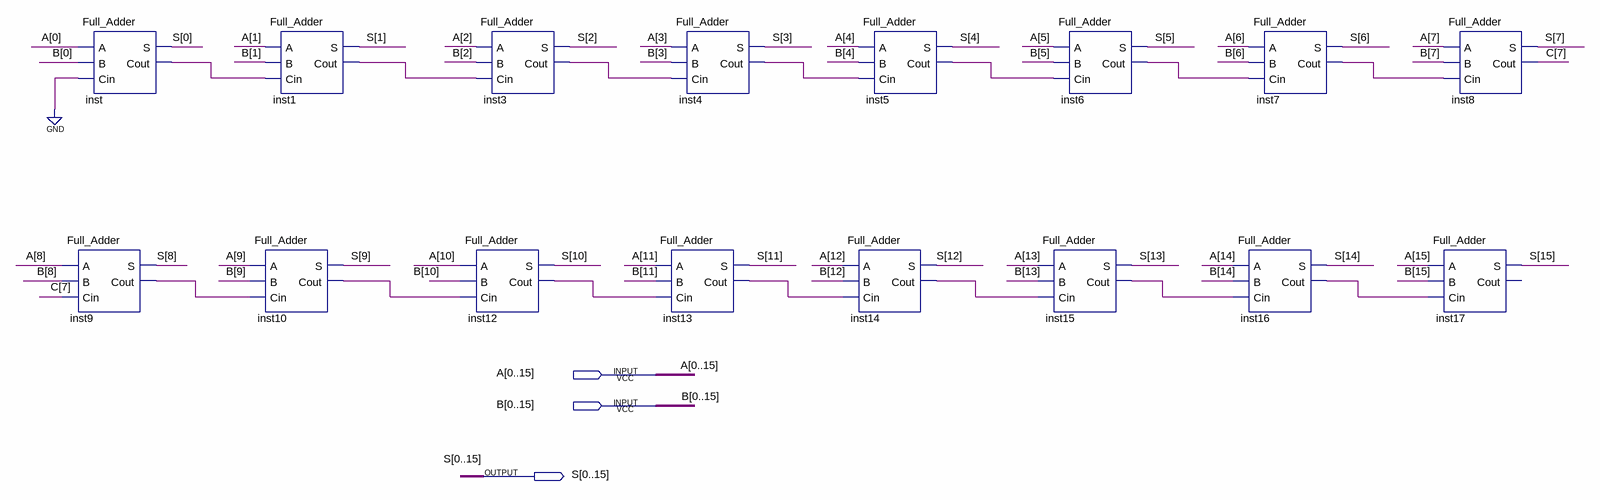
[diagram p0: schematic sheet]
// Quartus schematic adder16bit.bdf as structural Verilog: 16 symbols, 3 pins
module adder16bit (
  input  [0:15] A,
  input  [0:15] B,
  output [0:15] S
);

  wire inst1_cout, inst3_cout, inst4_cout, inst5_cout, inst6_cout, inst7_cout, inst9_cout, inst10_cout,
       inst12_cout, inst13_cout, inst14_cout, inst15_cout, inst16_cout, inst_cout;
  wire [7:7] C;

  Full_Adder inst (.A(A[0]), .B(B[0]), .Cin(1'b0), .S(S[0]), .Cout(inst_cout));
  Full_Adder inst9 (.A(A[8]), .B(B[8]), .Cin(C[7]), .S(S[8]), .Cout(inst9_cout));
  Full_Adder inst1 (.A(A[1]), .B(B[1]), .Cin(inst_cout), .S(S[1]), .Cout(inst1_cout));
  Full_Adder inst10 (.A(A[9]), .B(B[9]), .Cin(inst9_cout), .S(S[9]), .Cout(inst10_cout));
  Full_Adder inst3 (.A(A[2]), .B(B[2]), .Cin(inst1_cout), .S(S[2]), .Cout(inst3_cout));
  Full_Adder inst12 (.A(A[10]), .B(B[10]), .Cin(inst10_cout), .S(S[10]), .Cout(inst12_cout));
  Full_Adder inst4 (.A(A[3]), .B(B[3]), .Cin(inst3_cout), .S(S[3]), .Cout(inst4_cout));
  Full_Adder inst13 (.A(A[11]), .B(B[11]), .Cin(inst12_cout), .S(S[11]), .Cout(inst13_cout));
  Full_Adder inst5 (.A(A[4]), .B(B[4]), .Cin(inst4_cout), .S(S[4]), .Cout(inst5_cout));
  Full_Adder inst14 (.A(A[12]), .B(B[12]), .Cin(inst13_cout), .S(S[12]), .Cout(inst14_cout));
  Full_Adder inst6 (.A(A[5]), .B(B[5]), .Cin(inst5_cout), .S(S[5]), .Cout(inst6_cout));
  Full_Adder inst15 (.A(A[13]), .B(B[13]), .Cin(inst14_cout), .S(S[13]), .Cout(inst15_cout));
  Full_Adder inst7 (.A(A[6]), .B(B[6]), .Cin(inst6_cout), .S(S[6]), .Cout(inst7_cout));
  Full_Adder inst16 (.A(A[14]), .B(B[14]), .Cin(inst15_cout), .S(S[14]), .Cout(inst16_cout));
  Full_Adder inst8 (.A(A[7]), .B(B[7]), .Cin(inst7_cout), .S(S[7]), .Cout(C[7]));
  Full_Adder inst17 (.A(A[15]), .B(B[15]), .Cin(inst16_cout), .S(S[15]));  // open: Cout
endmodule
